# Altium project RHS_FEST22-EV_Rev1.PrjPCB
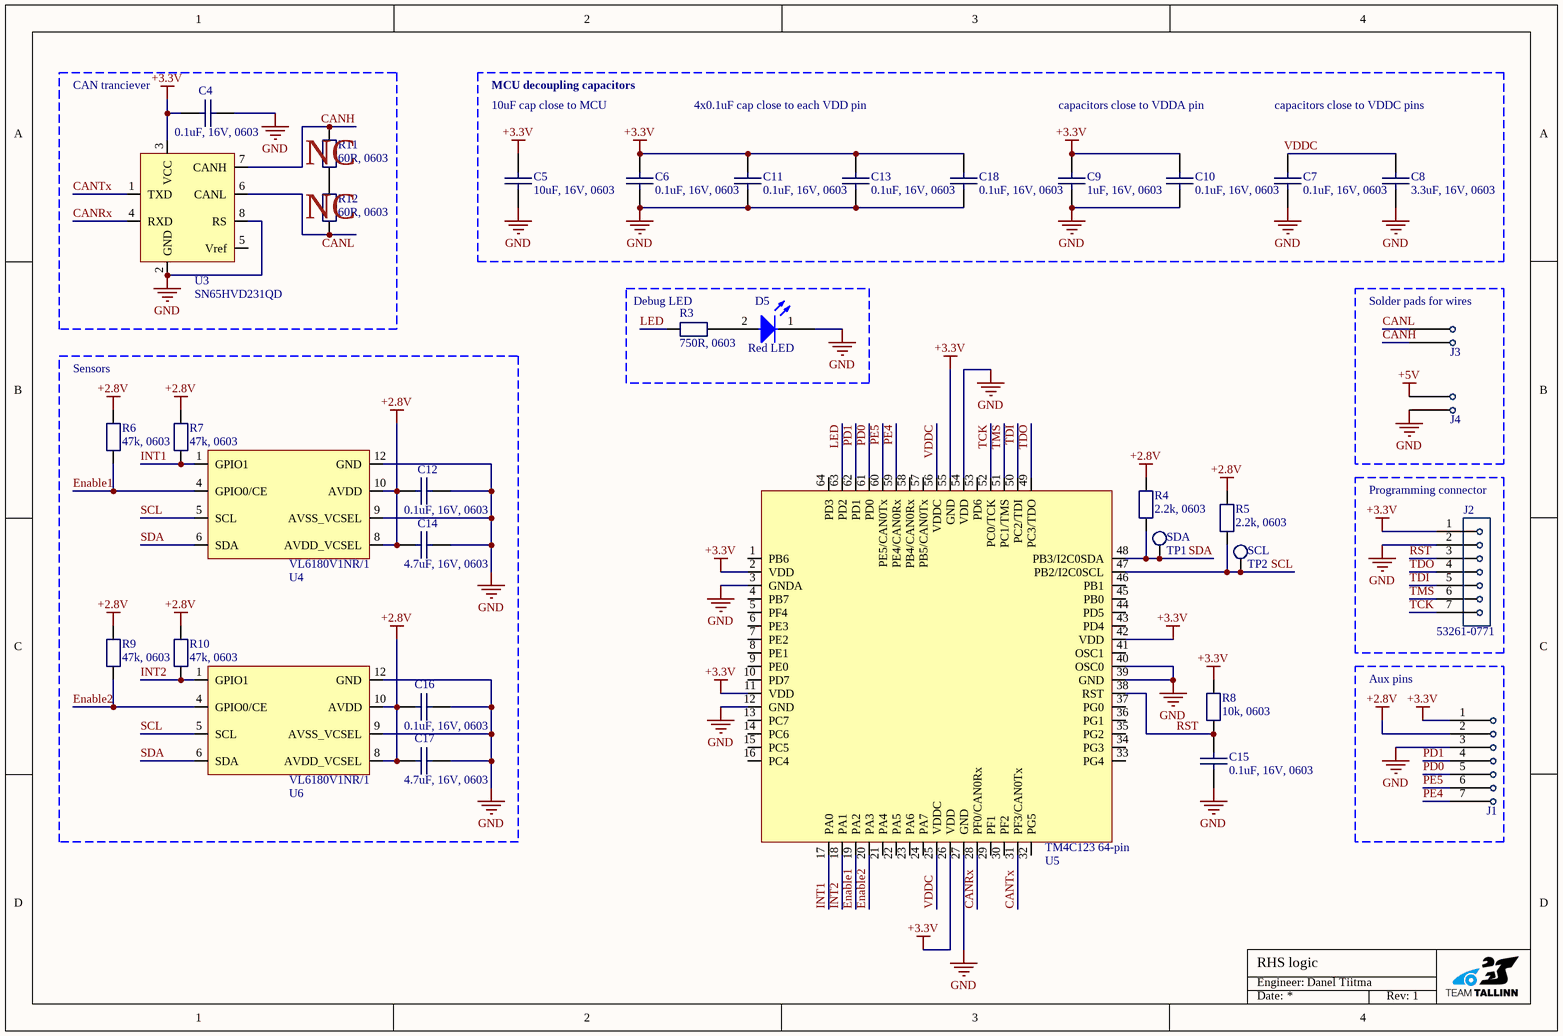
[diagram p0: RHS_FEST22-EV_Logic.SchDoc]
2 sheets, 48 parts. Net scope: global (net labels, ports and power ports of the same name join across sheets).
Board file: RHS_FEST22-EV_Rev1.PcbDoc
Sheets:
  RHS_FEST22-EV_Logic.SchDoc
  RHS_FEST22-EV_Power.SchDoc

## Sheet RHS_FEST22-EV_Logic.SchDoc: RHS logic
size A4; Engineer: Danel Tiitma; Organization: MTÜ Tudengi Vormel; Address1: Pärnu mnt 62; Address2: Tallinn; Address3: Estonia, 10135; Revision: 1; SheetNumber: 1; SheetTotal: 2

### Parts
C4  0.1uF, 16V, 0603  [CAP [0603] 1608]
C5  10uF, 16V, 0603  [CAP [0603] 1608]
C6  0.1uF, 16V, 0603  [CAP [0603] 1608]
C7  0.1uF, 16V, 0603  [CAP [0603] 1608]
C8  3.3uF, 16V, 0603  [CAP [0603] 1608]
C9  1uF, 16V, 0603  [CAP [0603] 1608]
C10  0.1uF, 16V, 0603  [CAP [0603] 1608]
C11  0.1uF, 16V, 0603  [CAP [0603] 1608]
C12  0.1uF, 16V, 0603  [CAP [0603] 1608]
C13  0.1uF, 16V, 0603  [CAP [0603] 1608]
C14  4.7uF, 16V, 0603  [CAP [0603] 1608]
C15  0.1uF, 16V, 0603  [CAP [0603] 1608]
C16  0.1uF, 16V, 0603  [CAP [0603] 1608]
C17  4.7uF, 16V, 0603  [CAP [0603] 1608]
C18  0.1uF, 16V, 0603  [CAP [0603] 1608]
D5  Red LED  [LED [0603] 1608]
J1  Wire connections_1  [Free pins]  (value not drawn)
J2  53261-0771  [Molex 53261-0771]
J3  Wire connections  [Wire pads]  (value not drawn)
J4  Wire connections  [Wire pads]  (value not drawn)
R3  750R, 0603  [RES [0603] 1608]
R4  2.2k, 0603  [RES [0603] 1608]
R5  2.2k, 0603  [RES [0603] 1608]
R6  47k, 0603  [RES [0603] 1608]
R7  47k, 0603  [RES [0603] 1608]
R8  10k, 0603  [RES [0603] 1608]
R9  47k, 0603  [RES [0603] 1608]
R10  47k, 0603  [RES [0603] 1608]
R11  60R, 0603  [RES [0603] 1608]
R12  60R, 0603  [RES [0603] 1608]
TP1  SDA  [Testpoint round 0.4mm]
TP2  SCL  [Testpoint round 0.4mm]
U3  SN65HVD231QD  [SOIC-8]
U4  VL6180V1NR/1  [VL6180]
U5  TM4C123 64-pin  [LQFP64]
U6  VL6180V1NR/1  [VL6180]

### Blocks framed on the sheet
Debug LED: D5 R3
Solder pads for wires: J3 J4
Sensors: C12 C14 C16 C17 R6 R7 R9 R10 U4 U6
Programming connector: J2
Aux pins: J1

### Nets
+2.8V: C12.2 C14.2 C16.2 C17.2 J1.2 R4.2 R5.2 R6.2 R7.2 R9.2 R10.2 U4.8(AVDD_VCSEL) U4.10(AVDD) U6.8(AVDD_VCSEL) U6.10(AVDD)
+3.3V: C4.2 C5.1 C6.2 C9.1 C10.1 C11.1 C13.1 C18.1 J1.1 J2.1(VCC) R8.1 U3.3(VCC) U5.2(VDD) U5.11(VDD) U5.26(VDD) U5.42(VDD) U5.55(GND)
+5V: J4.1
GND: C4.1 C5.2 C6.1 C7.1 C8.2 C9.2 C10.2 C11.2 C12.1 C13.2 C14.1 C15.2 C16.1 C17.1 C18.2 D5.1(A) J1.3 J2.2(GND) J4.2 U3.2(GND) U3.8(RS) U4.9(AVSS_VCSEL) U4.12(GND) U5.3(GNDA) U5.12(GND) U5.27(GND) U5.39(GND) U5.40(OSC0) U5.54(VDD) U6.9(AVSS_VCSEL) U6.12(GND)
CANH: J3.2 R11.2 U3.7(CANH)
CANL: J3.1 R12.1 U3.6(CANL)
CANRx: U3.4(RXD) U5.28(PF0/CAN0Rx)
CANTx: U3.1(TXD) U5.31(PF3/CAN0Tx)
Enable1: R6.1 U4.4(GPIO0/CE) U5.19(PA2)
Enable2: R9.1 U5.20(PA3) U6.4(GPIO0/CE)
INT1: R7.1 U4.1(GPIO1) U5.17(PA0)
INT2: R10.1 U5.18(PA1) U6.1(GPIO1)
LED: R3.2 U5.63(PD2)
PD0: J1.5 U5.61(PD0)
PD1: J1.4 U5.62(PD1)
PE4: J1.7 U5.59(PE4/CAN0Rx)
PE5: J1.6 U5.60(PE5/CAN0Tx)
RST: C15.1 J2.3(RST) R8.2 U5.38(RST)
SCL: R5.1 TP2.1(TEST) U4.5(SCL) U5.47(PB2/I2C0SCL) U6.5(SCL)
SDA: R4.1 TP1.1(TEST) U4.6(SDA) U5.48(PB3/I2C0SDA) U6.6(SDA)
TCK: J2.7(TCK) U5.52(PC0/TCK)
TDI: J2.5(TDI) U5.50(PC2/TDI)
TDO: J2.4(TDO) U5.49(PC3/TDO)
TMS: J2.6(TMS) U5.51(PC1/TMS)
VDDC: C7.2 C8.1 U5.25(VDDC) U5.56(VDDC)
NetD5_2: D5.2(K) R3.1
NetR11_1: R11.1 R12.2

Not connected (* = marked no-connect by the designer): U3 5(Vref); U5 1(PB6) 4(PB7) 5(PF4) 6(PE3) 7(PE2) 8(PE1) 9(PE0) 10(PD7) 13(PC7) 14(PC6) 15(PC5) 16(PC4) 21(PA4) 22(PA5) 23(PA6) 24(PA7) 29(PF1) 30(PF2) 32(PG5) 33(PG4) 34(PG3) 35(PG2) 36(PG1) 37(PG0) 41(OSC1) 43(PD4) 44(PD5) 45(PB0) 46(PB1) 53(PD6) 57(PB5/CAN0Tx) 58(PB4/CAN0Rx) 64(PD3)

### Notes on the sheet
- CAN tranciever
- 10uF cap close to MCU
- MCU decoupling capacitors
- 4x0.1uF cap close to each VDD pin
- capacitors close to VDDA pin
- capacitors close to VDDC pins
- (near R11) NC
- (near R12) NC
- Engineer:
- Date:
- Rev:

### Library data of the parts
C4 C6 C7 C10-C13 C15 C16 C18 = Cap 0.1uF: Manufacturer: MURATA; Order Step: 10; Product Name: GCM188L81H104KA57D; Datasheet: https://4donline.ihs.com/images/VipMasterIC/IC/MURE/MURE-S-A0010851662/MURE-S-A0010851692-1.pdf?hkey=6D3A4C79FDBF58556ACFDE234799DDF0; Notes: *; Price: 0.134; Supplier: Farnell; Supplier Number: 2781423
C5 = Cap 10uF: Manufacturer: MURATA; Order Step: 10; Product Name: GRM188R61A106MAALD; Datasheet: https://4donline.ihs.com/images/VipMasterIC/IC/MURE/MURE-S-A0010871772/MURE-S-A0010871249-1.pdf?hkey=6D3A4C79FDBF58556ACFDE234799DDF0; Notes: *; Price: 0.384; Supplier: Farnell; Supplier Number: 3581376
C8 = Cap 3.3uF: Manufacturer: TDK; Order Step: 10; Product Name: CGA3E1X5R1A335K080AC; Datasheet: https://www.farnell.com/datasheets/1807242.pdf; Notes: *; Price: 0.16; Supplier: Farnell; Supplier Number: 2210840
C9 = Cap 1uF: Manufacturer: MURATA; Order Step: 10; Product Name: GCJ188R71E105KA01D; Datasheet: https://www.farnell.com/datasheets/3158835.pdf; Notes: *; Price: 0.156; Supplier: Farnell; Supplier Number: 2781410
C14 C17 = Cap 4.7uF: Manufacturer: MURATA; Order Step: 10; Product Name: GRT188R61C475KE13D; Datasheet: *; Notes: *; Price: 0.45; Supplier: Farnell; Supplier Number: 3581438
D5 = Red LED: Manufacturer: KINGBRIGHT; Order Step: 5; Product Name: KPT-1608LVSECK-J3-PRV; Datasheet: http://www.farnell.com/datasheets/2068420.pdf?_ga=2.36173545.89986474.1576161266-1510626616.1539531469; Notes: *; Price: 0,419; Supplier: Farnell; Supplier Number: 2610406
J1 = Wire connections_1: Extra through holes
J2 = 53261-0771: Connector; Manufacturer: Molex; Order Step: 1; Datasheet: https://www.mouser.ee/ProductDetail/Molex/53261-0771?qs=%2Fha2pyFadugsCwNxBg3%2FRHDCLTseGEMg8wdDzDUpq7U%3D; Notes: *; Price: 0.669; Product Name: 53261-0771; Supplier: Mouser; Supplier Number: 538-53261-0771
R3 = RES 750: Manufacturer: YAGEO; Order Step: 10; Product Name: RC0603FR-07750RL; Datasheet: https://www.farnell.com/datasheets/3046031.pdf; Notes: *; Price: 0.0289; Supplier: Farnell; Supplier Number: 3495907
R4 R5 = Res 2.2k: Manufacturer: YAGEO; Order Step: 10; Product Name: AC0603FR-072K2L; Datasheet: https://www.farnell.com/datasheets/3046027.pdf; Notes: *; Price: 0.0369; Supplier: Farnell; Supplier Number: 3495253
R6 R7 R9 R10 = Res 47k: Manufacturer: YAGEO; Order Step: 10; Product Name: AC0603FR-0747KL; Datasheet: https://www.farnell.com/datasheets/3046027.pdf; Notes: *; Price: 0.038; Supplier: Farnell; Supplier Number: 3495270
R8 = Res 10k: Manufacturer: Yageo; Order Step: 10; Product Name: AC0603FR-0710KL; Datasheet: https://www.farnell.com/datasheets/3577113.pdf; Notes: *; Price: 0.0413; Supplier: Farnell; Supplier Number: 3495224
R11 R12 = Resistor: Datasheet: *; Manufacturer: *; Notes: *; Order Step: *; Product Name: *; Supplier: *; Supplier Number: *; Price (1st level): *; Price (5th level): *
TP1 TP2 = Test Point: Manufacturer: *; Supplier Number: *; Product Name: *; Datasheet: *; Notes: *; Order Step: *; Price (1st level): *; Price (5th level): *; Supplier: *
U3 = SN65HVD231QD: CAN tranciever; Manufacturer: Texas Instruments; Order Step: 1; Product Name: SN65HVD231QD; Supplier Number: 296-12704-5-ND; Datasheet: https://www.ti.com/lit/ds/symlink/sn65hvd231q-q1.pdf?HQS=dis-mous-null-mousermode-dsf-pf-null-wwe&ts=1637169427896&ref_url=https%253A%252F%252Fwww.mouser.ee%252F; Notes: *; Price: 3,93; Supplier: Digi-key
U4 U6 = VL6180V1NR/1: Time-of-Flight proximity sensor, 2.6V, 3V, Optical, RoHS; Manufacturer: STMicroelectronics; Order Step: 1; Product Name: VL6180V1NR/1; Supplier Number: 511-VL6180V1NR/1; Datasheet: https://www.mouser.ee/datasheet/2/389/dm00089971-1862074.pdf; Notes: *; Price: 3.53; Supplier: Mouser
U5 = TM4C123 64-pin: MCU 32-Bit Tiva C ARM Cortex M4F RISC 256KB Flash 1.2V/3.3V 64-Pin LQFP Tray/Tube; Manufacturer: Texas Instruments; Product Name: TM4C1230H6PMIR; Order Step: 1; Supplier Number: ‎296-43613-1-ND‎; Datasheet: https://www.ti.com/general/docs/suppproductinfo.tsp?distId=10&gotoUrl=https%3A%2F%2Fwww.ti.com%2Flit%2Fgpn%2Ftm4c1230h6pm; Notes: *; Price (1st level): 7.45; Supplier: Digi-Key

## Sheet RHS_FEST22-EV_Power.SchDoc: RHS power
size A4; Engineer: Danel Tiitma; Organization: MTÜ Tudengi Vormel; Address1: Pärnu mnt 62; Address2: Tallinn; Address3: Estonia, 10135; Revision: 1; SheetNumber: 2; SheetTotal: 2
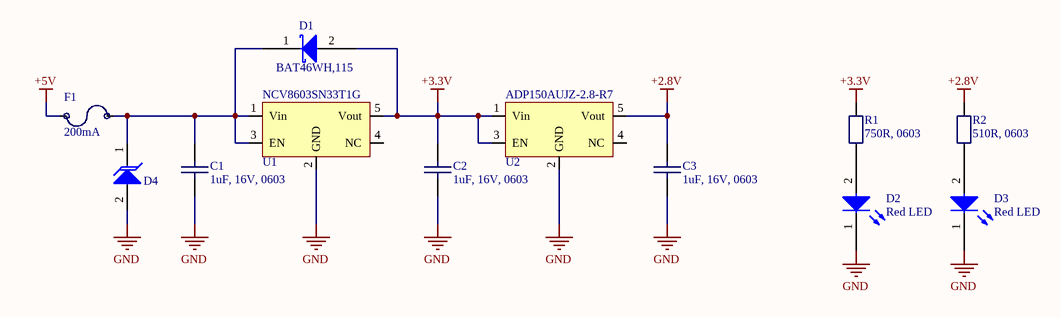
[diagram p1: RHS_FEST22-EV_Power.SchDoc]

### Parts
C1  1uF, 16V, 0603  [CAP [0603] 1608]
C2  1uF, 16V, 0603  [CAP [0603] 1608]
C3  1uF, 16V, 0603  [CAP [0603] 1608]
D1  BAT46WH,115  [SOD-123F]
D2  Red LED  [LED [0603] 1608]
D3  Red LED  [LED [0603] 1608]
D4  TV02W5V0-G  [SOD-123-2]  (value not drawn)
F1  200mA  [RES [0603] 1608]
R1  750R, 0603  [RES [0603] 1608]
R2  510R, 0603  [RES [0603] 1608]
U1  NCV8603SN33T1G  [TSOT-5]
U2  ADP150AUJZ-2.8-R7  [TSOT-5]

### Nets
+2.8V: C3.1 R2.1 U2.5(Vout)
+3.3V: C2.1 D1.2(K) R1.1 U1.5(Vout) U2.1(Vin) U2.3(EN)
+5V: F1.1
GND: C1.2 C2.2 C3.2 D2.1(A) D3.1(A) D4.2(A) U1.2(GND) U2.2(GND)
NetC1_1: C1.1 D1.1(A) D4.1(K) F1.2 U1.1(Vin) U1.3(EN)
NetD2_2: D2.2(K) R1.2
NetD3_2: D3.2(K) R2.2

Not connected (* = marked no-connect by the designer): U1 4(NC); U2 4(NC)

### Notes on the sheet
- Engineer:
- Date:
- Rev:

### Library data of the parts
C1-C3 = Cap 1uF: as C9 on sheet RHS_FEST22-EV_Logic; Datasheet: https://www.farnell.com/datasheets/3158835.pdf; Notes: *; Price: 0.156; Supplier: Farnell; Supplier Number: 2781410
D1 = BAT46WH,115: Schottky diode; Manufacturer: Nexperia; Order Step: 1; Datasheet: https://www.farnell.com/datasheets/1508345.pdf; Notes: *; Price: 0.298; Product Name: BAT46WH,115; Supplier: Mouser; Supplier Number: 771-BAT46WH115
D2 D3 = Red LED: as D5 on sheet RHS_FEST22-EV_Logic; Datasheet: http://www.farnell.com/datasheets/2068420.pdf?_ga=2.36173545.89986474.1576161266-1510626616.1539531469; Notes: *; Price: 0,419; Supplier: Farnell; Supplier Number: 2610406
D4 = TV02W5V0-G: TVS diode; Manufacturer: Comchip; Order Step: 1; Product Name: TV02W5V0-G; Supplier Number: 750-TV02W5V0-G; Datasheet: https://www.mouser.ee/datasheet/2/80/TV02W_G_series_RevE-2506525.pdf; Notes: *; Price: 0,368; Supplier: Mouser
F1 = Fuse: Manufacturer: Littlefuse; Product Name: 0467.250NR; Order Step: 10; Supplier Number: 1596942; Supplier: Farnell; Notes: *; Datasheet: https://www.farnell.com/datasheets/2282563.pdf; Price: 0.664
R1 = RES 750: as R3 on sheet RHS_FEST22-EV_Logic; Datasheet: https://www.farnell.com/datasheets/3046031.pdf; Notes: *; Price: 0.0289; Supplier: Farnell; Supplier Number: 3495907
R2 = Res 510: Manufacturer: YAGEO; Order Step: 10; Product Name: RC0603FR-07510RL; Datasheet: https://www.farnell.com/datasheets/3046031.pdf; Notes: *; Price: 0.0266; Supplier: Farnell; Supplier Number: 3495869
U1 = NCV8603SN33T1G: Linear voltage regulator; Manufacturer: onsemi; Order Step: 1; Product Name: NCV8603SN33T1G; Supplier Number: 863-NCV8603SN33T1G; Datasheet: https://www.mouser.ee/datasheet/2/308/1/NCV8603_D-2317642.pdf; Notes: *; Price: 0.613; Supplier: Mouser
U2 = ADP150AUJZ-2.8-R7: Linear voltage regulator; Manufacturer: Analog Devices; Order Step: 1; Product Name: ADP150AUJZ-2.8-R7; Supplier Number: 584-ADP150AUJZ-2.8R7; Datasheet: https://www.mouser.ee/datasheet/2/609/ADP150-1503284.pdf; Notes: *; Price: 0.97; Supplier: Mouser

## Nets that join several sheets
+2.8V: RHS_FEST22-EV_Logic (15 pins), RHS_FEST22-EV_Power (C3.1 R2.1 U2.5)
+3.3V: RHS_FEST22-EV_Logic (17 pins), RHS_FEST22-EV_Power (6 pins)
+5V: RHS_FEST22-EV_Logic (J4.1), RHS_FEST22-EV_Power (F1.1)
GND: RHS_FEST22-EV_Logic (31 pins), RHS_FEST22-EV_Power (8 pins)